# EAGLE schematic NANOEveryV3.0 (EAGLE 6.6.0)
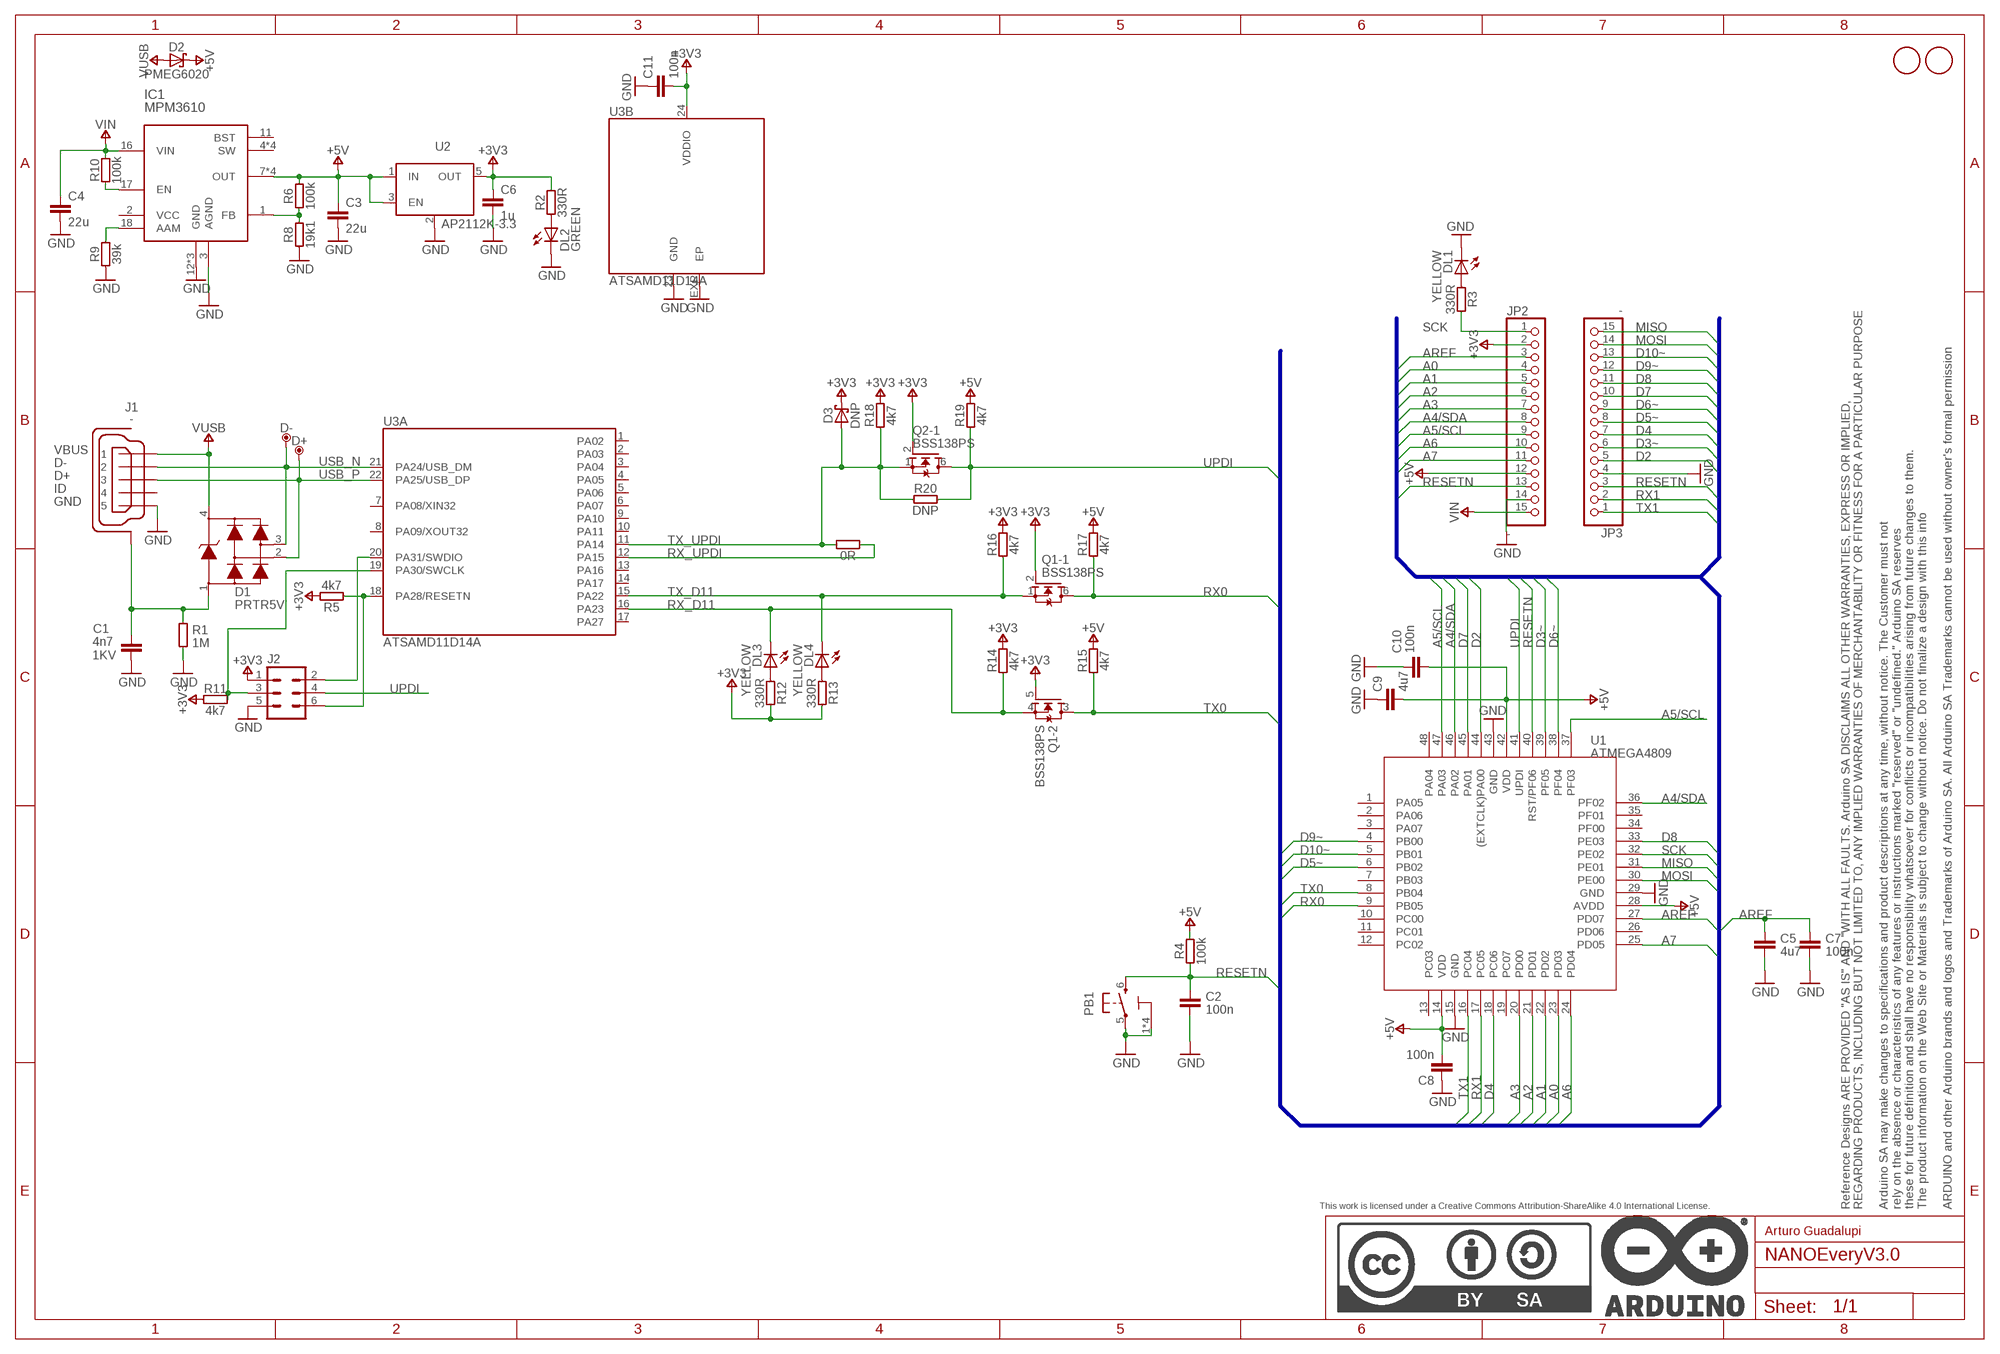
[diagram p0: schematic, sheet 1]

## Parts
C1  4n7  C4.7NF-0805  [0805-R2013X50N]
C2  100n  C-100NF-0402  [0402-1005X55N]
C3  22u  C-22U-0805  [0805-R2013X50N]
C4  22u  C-22U-0805  [0805-R2013X50N]
C5  4u7  C-4.7UF-0402  [0402-1005X55N]
C6  1u  C-1UF-0402  [0402-1005X55N]
C7  100n  C-100NF-0402  [0402-1005X55N]
C8  100n  C-100NF-0402  [0402-1005X55N]
C9  4u7  C-4.7UF-0402  [0402-1005X55N]
C10  100n  C-100NF-0402  [0402-1005X55N]
C11  100n  C-100NF-0402  [0402-1005X55N]
D1  PRTR5V  PRTR5V0U2X,215  [SOT190P230X110-4N]
D2  PMEG6020  PMEG6020AELRX  [SODFL3517X110N]
D3  DNP  PMEG6020AELRX-DNP  [SODFL3517X110N]
D+  DNP  TPTP-1.00MM  [TP-1.00MM]
D-  DNP  TPTP-1.00MM  [TP-1.00MM]
DL1  YELLOW  LED-YELLOW-0603  [LEDC1608X80N-AK]
DL2  GREEN  LED-GREEN-0603  [LEDC1608X80N-AK]
DL3  YELLOW  LED-YELLOW-0603  [LEDC1608X80N-AK]
DL4  YELLOW  LED-YELLOW-0603  [LEDC1608X80N-AK]
FD1  DNP  FIDUCIAL-1.5MM  [FD-1-1.5]
FD2  DNP  FIDUCIAL-1.5MM  [FD-1-1.5]
FRAME1  DNP  A3-FRAME  [FRAME]
IC1  MPM3610  [MPM3610]
J1  -  USB-MICRO  [ZX62-AB-5PA]
J2  DNP  PINHD-2X03-SMTP  [2X03-TP]
JP2  -  PINHD-1X15-CASTELLATED  [1X15-CASTELL]
JP3  -  PINHD-1X15-CASTELLATED  [1X15-CASTELL]
PB1  PTS820  TACTILE1PTS820-NH  [C&K_PTS820_NO_HOLES]
Q1  BSS138PS  [SOT363]
Q2  BSS138PS  [SOT363]
R1  1M  R-1M-0402  [0402-1005X55N]
R2  330R  R-330R-0402  [0402-1005X55N]
R3  330R  R-330R-0402  [0402-1005X55N]
R4  100k  R-100K-0402  [0402-1005X55N]
R5  4k7  R-4K7-0402  [0402-1005X55N]
R6  100k  R-100K-0402  [0402-1005X55N]
R7  0R  R-0R-0402  [0402-1005X55N]
R8  19k1  R-19K1-0402  [0402-1005X55N]
R9  39k  R-39K-0402  [0402-1005X55N]
R10  100k  R-100K-0402  [0402-1005X55N]
R11  4k7  R-4K7-0402  [0402-1005X55N]
R12  330R  R-330R-0402  [0402-1005X55N]
R13  330R  R-330R-0402  [0402-1005X55N]
R14  4k7  R-4K7-0402  [0402-1005X55N]
R15  4k7  R-4K7-0402  [0402-1005X55N]
R16  4k7  R-4K7-0402  [0402-1005X55N]
R17  4k7  R-4K7-0402  [0402-1005X55N]
R18  4k7  R-4K7-0402  [0402-1005X55N]
R19  4k7  R-4K7-0402  [0402-1005X55N]
R20  DNP  R-DNP-0402  [0402-1005X55N]
U1  ATMEGA4809  [TQFP48]
U2  AP2112K-3.3  [SOT25]
U3  ATSAMD11D14A  ATSAMD11D14  [HVQFN24]

## Nets
+3V3: C6.1 C11.2 D3.C J2.1 JP2.2 Q1.2(-1:G) Q1.5(-2:G) Q2.2(-1:G) R2.2 R5.2 R11.1 R12.2 R13.2 R14.2 R16.2 R18.2 U2.5(OUT) U3.24(B:VDDIO)
+5V: C3.1 C8.2 C9.2 C10.2 D2.C IC1.7(OUT) IC1.8(OUT) IC1.9(OUT) IC1.20(OUT) JP2.12 R4.2 R6.2 R15.2 R17.2 R19.2 U1.14(VDD) U1.28(AVDD) U1.42(VDD) U2.1(IN) U2.3(EN)
A0: JP2.4 U1.23(PD03)
A1: JP2.5 U1.22(PD02)
A2: JP2.6 U1.21(PD01)
A3: JP2.7 U1.20(PD00)
A4/SDA: JP2.8 U1.36(PF02) U1.46(PA02)
A5/SCL: JP2.9 U1.37(PF03) U1.47(PA03)
A6: JP2.10 U1.24(PD04)
A7: JP2.11 U1.25(PD05)
AREF: C5.1 C7.1 JP2.3 U1.27(PD07)
D2: JP3.5 U1.44((EXTCLK)PA00)
D3~: JP3.6 U1.39(PF05)
D4: JP3.7 U1.18(PC06)
D5~: JP3.8 U1.6(PB02)
D6~: JP3.9 U1.38(PF04)
D7: JP3.10 U1.45(PA01)
D8: JP3.11 U1.33(PE03)
D9~: JP3.12 U1.4(PB00)
D10~: JP3.13 U1.5(PB01)
D11_RESET: J2.6 R5.1 U3.18(A:PA28/RESETN)
D11_SWCLK: J2.3 R11.2 U3.19(A:PA30/SWCLK)
D11_SWDIO: J2.2 U3.20(A:PA31/SWDIO)
GND: C1.2 C2.2 C3.2 C4.2 C5.2 C6.2 C7.2 C8.1 C9.1 C10.1 C11.1 DL1.C DL2.C IC1.3(AGND) IC1.12(GND) IC1.13(GND) IC1.14(GND) J1.5 J2.5 JP2.14 JP3.4 PB1.1 PB1.2 PB1.3 PB1.4 PB1.5 R1.1 R8.1 R9.1 U1.15(GND) U1.29(GND) U1.43(GND) U2.2(GND/ADJ) U3.23(B:GND) U3.EXP(B:EP)
MISO: JP3.15 U1.31(PE01)
MOSI: JP3.14 U1.30(PE00)
N$1: C1.1 D1.1 J1.6(SH) J1.7(SH) J1.8(SH) J1.9(SH) J1.10(SH) J1.11(SH) R1.2
N$2: DL2.A R2.1
N$3: DL1.A R3.1
N$5: IC1.1(FB) R6.1 R8.2
N$6: IC1.18(AAM) R9.2
N$7: IC1.17(EN) R10.1
N$11: DL3.A R12.1
N$12: DL4.A R13.1
RESETN: C2.1 JP2.13 JP3.3 PB1.6 R4.1 U1.40(RST/PF06)
RX0: Q1.6(-1:D) R17.1 U1.9(PB05)
RX1: JP3.2 U1.17(PC05)
RX_D11: DL3.C Q1.4(-2:S) R14.1 U3.16(A:PA23)
RX_UPDI: R7.2 U3.12(A:PA15)
SCK: JP2.1 R3.2 U1.32(PE02)
TX0: Q1.3(-2:D) R15.1 U1.8(PB04)
TX1: JP3.1 U1.16(PC04)
TX_D11: DL4.C Q1.1(-1:S) R16.1 U3.15(A:PA22)
TX_UPDI: D3.A Q2.1(-1:S) R7.1 R18.1 R20.1 U3.11(A:PA14)
UPDI: J2.4 Q2.6(-1:D) R19.1 R20.2 U1.41(UPDI)
USB_N [usb]: D1.3 D-.X J1.2 U3.21(A:PA24/USB_DM)
USB_P [usb]: D1.2 D+.X J1.3 U3.22(A:PA25/USB_DP)
VIN: C4.1 IC1.16(VIN) JP2.15 R10.2
VUSB: D1.4 D2.A J1.1
Unconnected: IC1.2(VCC) IC1.4(SW) IC1.5(SW) IC1.6(SW) IC1.11(BST) IC1.19(SW) J1.4 Q2.3(-2:D) Q2.4(-2:S) Q2.5(-2:G) U1.1(PA05) U1.2(PA06) U1.3(PA07) U1.7(PB03) U1.10(PC00) U1.11(PC01) U1.12(PC02) U1.13(PC03) U1.19(PC07) U1.26(PD06) U1.34(PF00) U1.35(PF01) U1.48(PA04) U3.1(A:PA02) U3.2(A:PA03) U3.3(A:PA04) U3.4(A:PA05) U3.5(A:PA06) U3.6(A:PA07) U3.7(A:PA08/XIN32) U3.8(A:PA09/XOUT32) U3.9(A:PA10) U3.10(A:PA11) U3.13(A:PA16) U3.14(A:PA17) U3.17(A:PA27)

## Buses
A0,A1,A2,A3,A4/SDA,A5/SCL,A6,A7,AREF,D2,D3~,D4,D5~,D6~,D7,D8,D9~,D10~,MISO,MOSI,RESETN,RX0,RX1,SCK,TX1,UPDI,VIN

## Notes on the sheet
- Arturo Guadalupi

## Library data of the parts
C1 = Arduino-rcl:C: SMD Capacitor; CODE-ARDUINO: 0689; DATASHEET: http://www.kemet.com/Lists/ProductCatalog/Attachments/40/KEM_C1010_X7R_HV_SMD.pdf; DISTRIBUTOR-LINK: www.kemet.com/docfinder?Partnumber=C0805C472KDRACTU; DISTRIBUTOR-PN: 399-6738-1-ND; MANUFACTURER: Kemet; MANUFACTURER-PN: C0805C472KDRACTU; NOTE: -; VOLTAGE: 1KV
C2 C7 C8 C10 C11 = Arduino-rcl:C: SMD Capacitor; CODE-ARDUINO: 0132; DATASHEET: http://www.tdk.com/pdf/TDKMLCCCapRange.pdf; DISTRIBUTOR-LINK: http://www.digikey.com/product-detail/en/tdk-corporation/C1005X5R1H104K050BB/445-5942-1-ND/2443982; DISTRIBUTOR-PN: 445-5942-1-ND; MANUFACTURER: TDK; MANUFACTURER-PN: C1005X5R1H104K050BB; NOTE: -
C3 C4 = Arduino-rcl:C: SMD Capacitor; CODE-ARDUINO: 2233; DATASHEET: https://media.digikey.com/pdf/Data%20Sheets/Samsung%20PDFs/CL21A226MQCLQNC_character.pdf; DISTRIBUTOR-LINK: https://www.digikey.com/product-detail/en/samsung-electro-mechanics-america-inc/CL21A226MQCLQNC/1276-2412-1-ND/3890498; DISTRIBUTOR-PN: 1276-2412-1-ND; MANUFACTURER: Samsung; MANUFACTURER-PN: CL21A226MQCLQNC; NOTE: -
C5 C9 = Arduino-rcl:C: SMD Capacitor; CODE-ARDUINO: 0833; DATASHEET: http://search.murata.co.jp/Ceramy/image/img/A01X/partnumbering_e_01.pdf; DISTRIBUTOR-LINK: http://www.digikey.com/product-detail/en/murata-electronics-north-america/GRM155R60J475ME47D/490-5915-1-ND/3719860; DISTRIBUTOR-PN: 490-5915-1-ND; MANUFACTURER: Murata; MANUFACTURER-PN: GRM155R60J475ME47D; NOTE: -
C6 = Arduino-rcl:C: SMD Capacitor; CODE-ARDUINO: 0133; DATASHEET: http://search.murata.co.jp/Ceramy/image/img/A01X/partnumbering_e_01.pdf; DISTRIBUTOR-LINK: http://www.digikey.com/product-detail/en/murata-electronics-north-america/GRM155R61E105KA12D/490-10017-1-ND/5026367; DISTRIBUTOR-PN: 490-10017-1-ND; MANUFACTURER: Murata; MANUFACTURER-PN: GRM155R61E105KA12D; NOTE: -
D1 = Arduino-diodes:PRTR5V0U2X,215: USB ESD protection; CODE-ARDUINO: 2209; DATASHEET: http://www.nxp.com/documents/data_sheet/PRTR5V0U2X.pdf; DISTRIBUTOR-LINK: http://www.digikey.com/product-detail/en/nxp-semiconductors/PRTR5V0U2X,215/568-4140-1-ND/1589981; DISTRIBUTOR-PN: 568-4140-1-ND; MANUFACTURER: NXP; MANUFACTURER-PN: PRTR5V0U2X,215
D2 = Arduino-diodes:PMEG6020AELRX: 60 V, 2 A low leakage current Schottky barrier rectifier Datasheet <http://www.nxp.com/documents/data_sheet/PMEG6020AELR.pdf>; CODE-ARDUINO: 2208; DATASHEET: http://www.nxp.com/documents/data_sheet/PMEG6020AELR.pdf; DISTRIBUTOR-LINK: http://www.digikey.com/products/en?keywords=%20568-12710-1-ND; DISTRIBUTOR-PN: 568-12710-1-ND; MANUFACTURER: NXP; MANUFACTURER-PN: PMEG6020AELRX
D3 = Arduino-diodes:PMEG6020AELRX: 60 V, 2 A low leakage current Schottky barrier rectifier Datasheet <http://www.nxp.com/documents/data_sheet/PMEG6020AELR.pdf>; CODE-ARDUINO: DNP; DATASHEET: DNP; DISTRIBUTOR-LINK: DNP; DISTRIBUTOR-PN: DNP; MANUFACTURER: DNP; MANUFACTURER-PN: DNP
D+ D- = Arduino-utility:TP: Testpoint; CODE-ARDUINO: DNP; DATASHEET: DNP; DISTRIBUTOR-LINK: DNP; DISTRIBUTOR-PN: DNP; MANUFACTURER: DNP; MANUFACTURER-PN: DNP
DL1 DL3 DL4 = Arduino-diodes:LED: LED; CODE-ARDUINO: 2243; DATASHEET: http://media.digikey.com/pdf/Data%20Sheets/Avago%20PDFs/HSMz-Czzz.pdf; DISTRIBUTOR-LINK: http://www.digikey.com/product-detail/en/broadcom-limited/HSMY-C190/516-1424-1-ND/637748; DISTRIBUTOR-PN: 516-1424-1-ND; MANUFACTURER: Avago; MANUFACTURER-PN: HSMY-C190
DL2 = Arduino-diodes:LED: LED; CODE-ARDUINO: 2204; DATASHEET: http://media.digikey.com/pdf/Data%20Sheets/Avago%20PDFs/HSMz-Czzz.pdf; DISTRIBUTOR-LINK: http://www.digikey.com/product-detail/en/broadcom-limited/HSMG-C190/516-1425-1-ND/637749; DISTRIBUTOR-PN: 516-1425-1-ND; MANUFACTURER: Avago; MANUFACTURER-PN: HSMG-C190
FD1 FD2 = Arduino-utility:FIDUCIAL: Fiducial mount; CODE-ARDUINO: DNP; DATASHEET: DNP; DISTRIBUTOR-LINK: DNP; DISTRIBUTOR-PN: DNP; MANUFACTURER: DNP; MANUFACTURER-PN: DNP
FRAME1 = Arduino-utility:A3-FRAME; CODE-ARDUINO: DNP; DATASHEET: DNP; DISTRIBUTOR-LINK: DNP; DISTRIBUTOR-PN: DNP; MANUFACTURER: DNP; MANUFACTURER-PN: DNP; NOTE: DNP
IC1 = Arduino-ICs:MPM3610: MPM3610 Step Down Regulator; CODE-ARDUINO: 2093; DATASHEET: https://www.monolithicpower.com/pub/media/document/MPM3610_r1.01.pdf; DISTRIBUTOR-LINK: https://www.digikey.com/product-detail/en/monolithic-power-systems-inc/MPM3610AGQV-P/1589-1249-1-ND/5298336; DISTRIBUTOR-PN: 1589-1249-1-ND; MANUFACTURER: MPS; MANUFACTURER-PN: MPM3610AGQV-P; RESTRICTIONS: NO
J1 = Arduino-connectors:USB-MICRO: USB - micro AB USB 2.0 Receptacle Connector 5 Position Surface Mount, Right Angle, Horizontal; CODE-ARDUINO: 2219; DATASHEET: https://www.hirose.com/product/en/download_file/key_name/ZX/category/Catalog/doc_file_id/31704/?file_category_id=4&item_id=13&is_series=1; DISTRIBUTOR-LINK: http://www.digikey.com/product-detail/en/hirose-electric-co-ltd/ZX62-AB-5PA(31)/H125279CT-ND/5994741; DISTRIBUTOR-PN: H125279CT-ND; MANUFACTURER: Hirose; MANUFACTURER-PN: ZX62-AB-5PA(31)
J2 = Arduino-connectors:PINHD-2X03-SM: PIN HEADER; CODE-ARDUINO: DNP; DATASHEET: DNP; DISTRIBUTOR-LINK: DNP; DISTRIBUTOR-PN: DNP; MANUFACTURER: DNP; MANUFACTURER-PN: DNP; NOTE: DNP
JP2 JP3 = Arduino-connectors:PINHD-1X15: PIN HEADER; CODE-ARDUINO: 0646; DATASHEET: -; DISTRIBUTOR-LINK: -; DISTRIBUTOR-PN: -; MANUFACTURER: -; MANUFACTURER-PN: -; NOTE: DNM
PB1 = Arduino-pushbuttons:TACTILE1: Tactile Switch SPST-NO Top Actuated Surface Mount; CODE-ARDUINO: 0173; DATASHEET: http://www.ckswitches.com/media/1474/pts820.pdf; DISTRIBUTOR-LINK: https://www.digikey.com/product-detail/en/c-k/PTS820-J15M-SMTR-LFS/CKN10506CT-ND/4176681; DISTRIBUTOR-PN: PTS820 J25K SMTR LFS-ND; MANUFACTURER: C&K; MANUFACTURER-PN: PTS820 J25K SMTR LFS
Q1 Q2 = Arduino-transistors:BSS138PS: MOSFET 2N-CH 60V 0.32A 6TSSOP; CODE-ARDUINO: 2323; DATASHEET: https://assets.nexperia.com/documents/data-sheet/BSS138PS.pdf; DISTRIBUTOR-LINK: http://www.digikey.com/product-detail/en/nxp-semiconductors/BSS138PS,115/568-8393-1-ND/2763927; DISTRIBUTOR-PN: 568-8393-1-ND; MANUFACTURER: NXP; MANUFACTURER-PN: BSS138PS,115
R1 = Arduino-rcl:R: SMD Resistor; CODE-ARDUINO: 0139; DATASHEET: www.yageo.com.tw/exep/pages/download/literatures/PYu-R_INT-thick_7.pdf; DISTRIBUTOR-LINK: http://www.digikey.com/product-detail/en/yageo/RC0402JR-07330RL/311-330JRCT-ND/729412; DISTRIBUTOR-PN: 311-330JRCT-ND; MANUFACTURER: Yageo; MANUFACTURER-PN: RC0402JR-07330RL; NOTE: NO
R2 R3 R12 R13 = Arduino-rcl:R: SMD Resistor; CODE-ARDUINO: 2229; DATASHEET: www.yageo.com.tw/exep/pages/download/literatures/PYu-R_INT-thick_7.pdf; DISTRIBUTOR-LINK: http://www.digikey.com/product-detail/en/yageo/RC0402FR-07330RL/311-330LRCT-ND/729541; DISTRIBUTOR-PN: 311-330LRCT-ND; MANUFACTURER: Yageo; MANUFACTURER-PN: RC0402FR-07330RL; NOTE: NO
R4 R6 R10 = Arduino-rcl:R: SMD Resistor; CODE-ARDUINO: 0134; DATASHEET: www.yageo.com.tw/exep/pages/download/literatures/PYu-R_INT-thick_7.pdf; DISTRIBUTOR-LINK: http://www.digikey.com/product-detail/en/yageo/RC0402FR-07100KL/311-100KLRCT-ND/729473; DISTRIBUTOR-PN: 311-100KLRCT-ND; MANUFACTURER: Yageo; MANUFACTURER-PN: RC0402FR-07100KL; NOTE: NO
R5 R11 R14-R19 = Arduino-rcl:R: SMD Resistor; CODE-ARDUINO: 2196; DATASHEET: www.yageo.com.tw/exep/pages/download/literatures/PYu-R_INT-thick_7.pdf; DISTRIBUTOR-LINK: http://www.digikey.com/product-detail/en/yageo/RC0402FR-074K7L/311-4.7KLRCT-ND/2827881; DISTRIBUTOR-PN: 311-4.7KLRCT-ND; MANUFACTURER: Yageo; MANUFACTURER-PN: RC0402FR-074K7L; NOTE: NO
R7 = Arduino-rcl:R: SMD Resistor; CODE-ARDUINO: 0039; DATASHEET: www.yageo.com.tw/exep/pages/download/literatures/PYu-R_INT-thick_7.pdf; DISTRIBUTOR-LINK: http://www.digikey.com/product-detail/en/yageo/RC0402FR-070RL/311-0.0LRCT-ND/2827888; DISTRIBUTOR-PN: 311-0.0LRCT-ND; MANUFACTURER: Yageo; MANUFACTURER-PN: RC0402FR-070RL; NOTE: NO
R8 = Arduino-rcl:R: SMD Resistor; CODE-ARDUINO: A5369; DATASHEET: http://www.yageo.com/documents/recent/PYu-RC_Group_51_RoHS_L_10.pdf; DISTRIBUTOR-LINK: https://www.digikey.it/product-detail/it/yageo/RC0402FR-0719K1L/311-19.1KLRTR-ND/726552; DISTRIBUTOR-PN: 311-19.1KLRTR-ND; MANUFACTURER: Yageo; MANUFACTURER-PN: RC0402FR-0719K1L; NOTE: NO
R9 = Arduino-rcl:R: SMD Resistor; CODE-ARDUINO: A5479; DATASHEET: www.yageo.com.tw/exep/pages/download/literatures/PYu-R_INT-thick_7.pdf; DISTRIBUTOR-LINK: https://www.digikey.com/product-detail/en/yageo/RC0402JR-0739KL/311-39KJRCT-ND/729420; DISTRIBUTOR-PN: 311-39KJRCT-ND; MANUFACTURER: Yageo; MANUFACTURER-PN: RC0402JR-0739KL; NOTE: NO
R20 = Arduino-rcl:R: SMD Resistor; CODE-ARDUINO: DNP; DATASHEET: DNP; DISTRIBUTOR-LINK: DNP; DISTRIBUTOR-PN: DNP; MANUFACTURER: DNP; MANUFACTURER-PN: DNP; NOTE: NO
U1 = Arduino-ucs&SoCs:ATMEGA4809: ATMEGA4809; CODE-ARDUINO: ATMEGA4809; DATASHEET: http://ww1.microchip.com/downloads/en/DeviceDoc/40002016A.pdf; DISTRIBUTOR-LINK: https://www.digikey.com/product-detail/en/microchip-technology/ATMEGA4809-AFR/ATMEGA4809-AFRCT-ND/8540756; DISTRIBUTOR-PN: ATMEGA4809-AFRCT-ND; MANUFACTURER: Microchip; MANUFACTURER-PN: ATMEGA4809-AFR
U2 = Arduino-ICs:AP2112K-3.3: IC REG LINEAR 3.3V 600mA SOT25; CODE-ARDUINO: 2199; DATASHEET: https://www.diodes.com/assets/Datasheets/AP2112.pdf; DISTRIBUTOR-LINK: https://www.digikey.com/product-detail/en/diodes-incorporated/AP2112K-3.3TRG1/AP2112K-3.3TRG1DITR-ND/4470746; DISTRIBUTOR-PN: AP2112K-3.3TRG1DITR-ND; MANUFACTURER: Diodes Inc; MANUFACTURER-PN: AP2112K-3.3TRG1; NOTE: NO
U3 = Arduino-ucs&SoCs:ATSAMD11D14: IC MCU 32BIT 16KB FLASH 24QFN; CODE-ARDUINO: ATSAM-D11-D14A-MUT; DATASHEET: http://ww1.microchip.com/downloads/en/DeviceDoc/Atmel-42363-SAM-D11_Datasheet.pdf; DISTRIBUTOR-LINK: https://www.digikey.com/product-detail/it/microchip-technology/ATSAMD11D14A-MUT/ATSAMD11D14A-MUTCT-ND/5226480; DISTRIBUTOR-PN: ATSAMD11D14A-MUTCT-ND; MANUFACTURER: Microchip; MANUFACTURER-PN: ATSAMD11D14A-MUT

## Net classes
0 default: width 0.19 mm, drill 0.19 mm
1 usb: width 0.19 mm, drill 0.19 mm, clearance 0.127 mm